# Altium schematic sheet 十二进十二出.SchDoc: Dozen IO控制器
size A4; Revision: V1.5; SheetNumber: 0; SheetTotal: 0; DrawnBy: 小熊
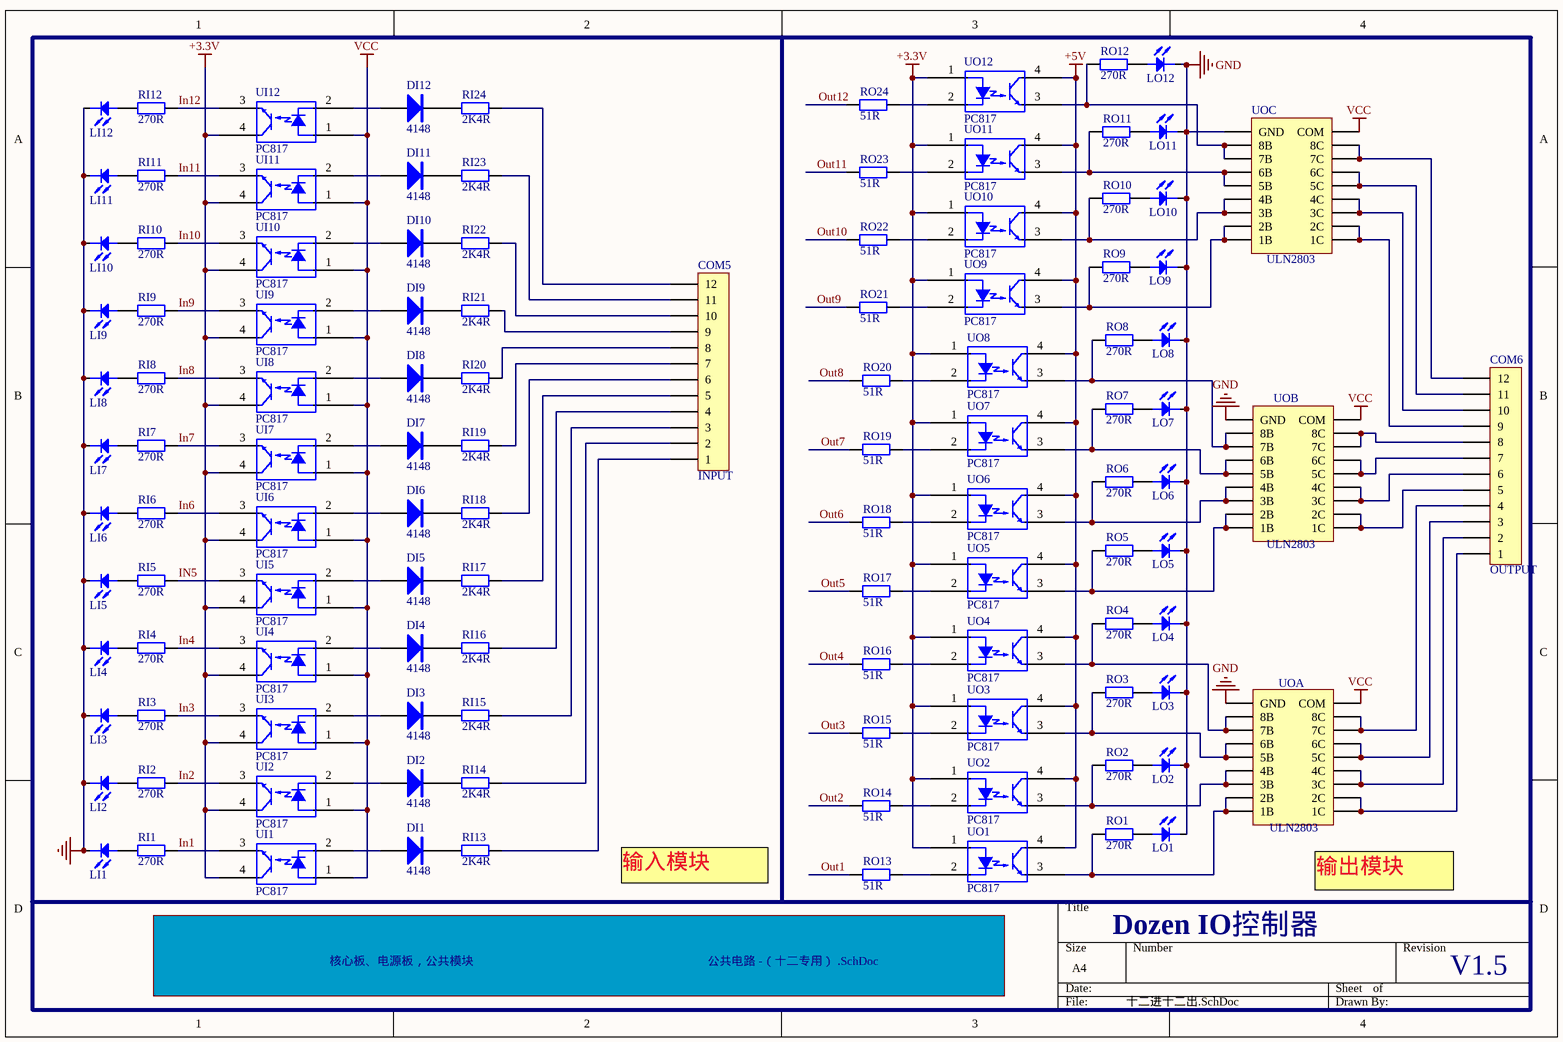
[diagram p0: 十二进十二出.SchDoc]

## Parts
COM5  INPUT  [CON12-5.1卧上]
COM6  OUTPUT  [CON12-5.1卧下]
DI1  4148  [1206C]
DI2  4148  [1206C]
DI3  4148  [1206C]
DI4  4148  [1206C]
DI5  4148  [1206C]
DI6  4148  [1206C]
DI7  4148  [1206C]
DI8  4148  [1206C]
DI9  4148  [1206C]
DI10  4148  [1206C]
DI11  4148  [1206C]
DI12  4148  [1206C]
LI1  LED  [SMDLED]  (value not drawn)
LI2  LED  [SMDLED]  (value not drawn)
LI3  LED  [SMDLED]  (value not drawn)
LI4  LED  [SMDLED]  (value not drawn)
LI5  LED  [SMDLED]  (value not drawn)
LI6  LED  [SMDLED]  (value not drawn)
LI7  LED  [SMDLED]  (value not drawn)
LI8  LED  [SMDLED]  (value not drawn)
LI9  LED  [SMDLED]  (value not drawn)
LI10  LED  [SMDLED]  (value not drawn)
LI11  LED  [SMDLED]  (value not drawn)
LI12  LED  [SMDLED]  (value not drawn)
LO1  LED  [SMDLED]  (value not drawn)
LO2  LED  [SMDLED]  (value not drawn)
LO3  LED  [SMDLED]  (value not drawn)
LO4  LED  [SMDLED]  (value not drawn)
LO5  LED  [SMDLED]  (value not drawn)
LO6  LED  [SMDLED]  (value not drawn)
LO7  LED  [SMDLED]  (value not drawn)
LO8  LED  [SMDLED]  (value not drawn)
LO9  LED  [SMDLED]  (value not drawn)
LO10  LED  [SMDLED]  (value not drawn)
LO11  LED  [SMDLED]  (value not drawn)
LO12  LED  [SMDLED]  (value not drawn)
RI1  270R  [0603A]
RI2  270R  [0603A]
RI3  270R  [0603A]
RI4  270R  [0603A]
RI5  270R  [0603A]
RI6  270R  [0603A]
RI7  270R  [0603A]
RI8  270R  [0603A]
RI9  270R  [0603A]
RI10  270R  [0603A]
RI11  270R  [0603A]
RI12  270R  [0603A]
RI13  2K4R  [0603A]
RI14  2K4R  [0603A]
RI15  2K4R  [0603A]
RI16  2K4R  [0603A]
RI17  2K4R  [0603A]
RI18  2K4R  [0603A]
RI19  2K4R  [0603A]
RI20  2K4R  [0603A]
RI21  2K4R  [0603A]
RI22  2K4R  [0603A]
RI23  2K4R  [0603A]
RI24  2K4R  [0603A]
RO1  270R  [0603A]
RO2  270R  [0603A]
RO3  270R  [0603A]
RO4  270R  [0603A]
RO5  270R  [0603A]
RO6  270R  [0603A]
RO7  270R  [0603A]
RO8  270R  [0603A]
RO9  270R  [0603A]
RO10  270R  [0603A]
RO11  270R  [0603A]
RO12  270R  [0603A]
RO13  51R  [0603A]
RO14  51R  [0603A]
RO15  51R  [0603A]
RO16  51R  [0603A]
RO17  51R  [0603A]
RO18  51R  [0603A]
RO19  51R  [0603A]
RO20  51R  [0603A]
RO21  51R  [0603A]
RO22  51R  [0603A]
RO23  51R  [0603A]
RO24  51R  [0603A]
UI1  PC817  [PC817]
UI2  PC817  [PC817]
UI3  PC817  [PC817]
UI4  PC817  [PC817]
UI5  PC817  [PC817]
UI6  PC817  [PC817]
UI7  PC817  [PC817]
UI8  PC817  [PC817]
UI9  PC817  [PC817]
UI10  PC817  [PC817]
UI11  PC817  [PC817]
UI12  PC817  [PC817]
UO1  PC817  [PC817]
UO2  PC817  [PC817]
UO3  PC817  [PC817]
UO4  PC817  [PC817]
UO5  PC817  [PC817]
UO6  PC817  [PC817]
UO7  PC817  [PC817]
UO8  PC817  [PC817]
UO9  PC817  [PC817]
UO10  PC817  [PC817]
UO11  PC817  [PC817]
UO12  PC817  [PC817]
UOA  ULN2803  [sol18]
UOB  ULN2803  [sol18]
UOC  ULN2803  [sol18]

## Sub-sheets
核心板、电源板，公共模块 = 公共电路 -（十二专用） .SchDoc: no entries

## Nets
+3.3V: UI1.4(COL) UI2.4(COL) UI3.4(COL) UI4.4(COL) UI5.4(COL) UI6.4(COL) UI7.4(COL) UI8.4(COL) UI9.4(COL) UI10.4(COL) UI11.4(COL) UI12.4(COL) UO1.1(ANODE) UO2.1(ANODE) UO3.1(ANODE) UO4.1(ANODE) UO5.1(ANODE) UO6.1(ANODE) UO7.1(ANODE) UO8.1(ANODE) UO9.1(ANODE) UO10.1(ANODE) UO11.1(ANODE) UO12.1(ANODE)
+5V: UO1.4(COL) UO2.4(COL) UO3.4(COL) UO4.4(COL) UO5.4(COL) UO6.4(COL) UO7.4(COL) UO8.4(COL) UO9.4(COL) UO10.4(COL) UO11.4(COL) UO12.4(COL)
GND: LI1.K LI2.K LI3.K LI4.K LI5.K LI6.K LI7.K LI8.K LI9.K LI10.K LI11.K LI12.K LO1.K LO2.K LO3.K LO4.K LO5.K LO6.K LO7.K LO8.K LO9.K LO10.K LO11.K LO12.K UOA.9(GND) UOB.9(GND) UOC.9(GND)
VCC: UI1.1(ANODE) UI2.1(ANODE) UI3.1(ANODE) UI4.1(ANODE) UI5.1(ANODE) UI6.1(ANODE) UI7.1(ANODE) UI8.1(ANODE) UI9.1(ANODE) UI10.1(ANODE) UI11.1(ANODE) UI12.1(ANODE) UOA.10(COM) UOB.10(COM) UOC.10(COM)
In1: RI1.1 UI1.3(EMIT)
In2: RI2.1 UI2.3(EMIT)
In3: RI3.1 UI3.3(EMIT)
In4: RI4.1 UI4.3(EMIT)
IN5: RI5.1 UI5.3(EMIT)
In6: RI6.1 UI6.3(EMIT)
In7: RI7.1 UI7.3(EMIT)
In8: RI8.1 UI8.3(EMIT)
In9: RI9.1 UI9.3(EMIT)
In10: RI10.1 UI10.3(EMIT)
In11: RI11.1 UI11.3(EMIT)
In12: RI12.1 UI12.3(EMIT)
Out1: RO13.1
Out2: RO14.1
Out3: RO15.1
Out4: RO16.1
Out5: RO17.1
Out6: RO18.1
Out7: RO19.1
Out8: RO20.1
Out9: RO21.1
Out10: RO22.1
Out11: RO23.1
Out12: RO24.1
NetCOM5_1: COM5.1 RI13.2
NetCOM5_2: COM5.2 RI14.2
NetCOM5_3: COM5.3 RI15.2
NetCOM5_4: COM5.4 RI16.2
NetCOM5_5: COM5.5 RI17.2
NetCOM5_6: COM5.6 RI18.2
NetCOM5_7: COM5.7 RI19.2
NetCOM5_8: COM5.8 RI20.2
NetCOM5_9: COM5.9 RI21.2
NetCOM5_10: COM5.10 RI22.2
NetCOM5_11: COM5.11 RI23.2
NetCOM5_12: COM5.12 RI24.2
NetCOM6_1: COM6.1 UOA.17(2C) UOA.18(1C)
NetCOM6_2: COM6.2 UOA.15(4C) UOA.16(3C)
NetCOM6_3: COM6.3 UOA.13(6C) UOA.14(5C)
NetCOM6_4: COM6.4 UOA.11(8C) UOA.12(7C)
NetCOM6_5: COM6.5 UOB.17(2C) UOB.18(1C)
NetCOM6_6: COM6.6 UOB.15(4C) UOB.16(3C)
NetCOM6_7: COM6.7 UOB.13(6C) UOB.14(5C)
NetCOM6_8: COM6.8 UOB.11(8C) UOB.12(7C)
NetCOM6_9: COM6.9 UOC.17(2C) UOC.18(1C)
NetCOM6_10: COM6.10 UOC.15(4C) UOC.16(3C)
NetCOM6_11: COM6.11 UOC.13(6C) UOC.14(5C)
NetCOM6_12: COM6.12 UOC.11(8C) UOC.12(7C)
NetDI1_A: DI1.A UI1.2(CATH)
NetDI1_K: DI1.K RI13.1
NetDI2_A: DI2.A UI2.2(CATH)
NetDI2_K: DI2.K RI14.1
NetDI3_A: DI3.A UI3.2(CATH)
NetDI3_K: DI3.K RI15.1
NetDI4_A: DI4.A UI4.2(CATH)
NetDI4_K: DI4.K RI16.1
NetDI5_A: DI5.A UI5.2(CATH)
NetDI5_K: DI5.K RI17.1
NetDI6_A: DI6.A UI6.2(CATH)
NetDI6_K: DI6.K RI18.1
NetDI7_A: DI7.A UI7.2(CATH)
NetDI7_K: DI7.K RI19.1
NetDI8_A: DI8.A UI8.2(CATH)
NetDI8_K: DI8.K RI20.1
NetDI9_A: DI9.A UI9.2(CATH)
NetDI9_K: DI9.K RI21.1
NetDI10_A: DI10.A UI10.2(CATH)
NetDI10_K: DI10.K RI22.1
NetDI11_A: DI11.A UI11.2(CATH)
NetDI11_K: DI11.K RI23.1
NetDI12_A: DI12.A UI12.2(CATH)
NetDI12_K: DI12.K RI24.1
NetLI1_A: LI1.A RI1.2
NetLI2_A: LI2.A RI2.2
NetLI3_A: LI3.A RI3.2
NetLI4_A: LI4.A RI4.2
NetLI5_A: LI5.A RI5.2
NetLI6_A: LI6.A RI6.2
NetLI7_A: LI7.A RI7.2
NetLI8_A: LI8.A RI8.2
NetLI9_A: LI9.A RI9.2
NetLI10_A: LI10.A RI10.2
NetLI11_A: LI11.A RI11.2
NetLI12_A: LI12.A RI12.2
NetLO1_A: LO1.A RO1.2
NetLO2_A: LO2.A RO2.2
NetLO3_A: LO3.A RO3.2
NetLO4_A: LO4.A RO4.2
NetLO5_A: LO5.A RO5.2
NetLO6_A: LO6.A RO6.2
NetLO7_A: LO7.A RO7.2
NetLO8_A: LO8.A RO8.2
NetLO9_A: LO9.A RO9.2
NetLO10_A: LO10.A RO10.2
NetLO11_A: LO11.A RO11.2
NetLO12_A: LO12.A RO12.2
NetRO1_1: RO1.1 UO1.3(EMIT) UOA.1(1B) UOA.2(2B)
NetRO2_1: RO2.1 UO2.3(EMIT) UOA.3(3B) UOA.4(4B)
NetRO3_1: RO3.1 UO3.3(EMIT) UOA.5(5B) UOA.6(6B)
NetRO4_1: RO4.1 UO4.3(EMIT) UOA.7(7B) UOA.8(8B)
NetRO5_1: RO5.1 UO5.3(EMIT) UOB.1(1B) UOB.2(2B)
NetRO6_1: RO6.1 UO6.3(EMIT) UOB.3(3B) UOB.4(4B)
NetRO7_1: RO7.1 UO7.3(EMIT) UOB.5(5B) UOB.6(6B)
NetRO8_1: RO8.1 UO8.3(EMIT) UOB.7(7B) UOB.8(8B)
NetRO9_1: RO9.1 UO9.3(EMIT) UOC.1(1B) UOC.2(2B)
NetRO10_1: RO10.1 UO10.3(EMIT) UOC.3(3B) UOC.4(4B)
NetRO11_1: RO11.1 UO11.3(EMIT) UOC.5(5B) UOC.6(6B)
NetRO12_1: RO12.1 UO12.3(EMIT) UOC.7(7B) UOC.8(8B)
NetRO13_2: RO13.2 UO1.2(CATH)
NetRO14_2: RO14.2 UO2.2(CATH)
NetRO15_2: RO15.2 UO3.2(CATH)
NetRO16_2: RO16.2 UO4.2(CATH)
NetRO17_2: RO17.2 UO5.2(CATH)
NetRO18_2: RO18.2 UO6.2(CATH)
NetRO19_2: RO19.2 UO7.2(CATH)
NetRO20_2: RO20.2 UO8.2(CATH)
NetRO21_2: RO21.2 UO9.2(CATH)
NetRO22_2: RO22.2 UO10.2(CATH)
NetRO23_2: RO23.2 UO11.2(CATH)
NetRO24_2: RO24.2 UO12.2(CATH)

## Notes on the sheet
- 输入模块
- (near UOA) 输出模块

## Library data of the parts
COM5 COM6 = CON12
RI1-RI24 RO1-RO24 = Res2: Resistor; Value: 1K; Published: 8-Jun-2000; LatestRevisionDate: 17-Jul-2002; LatestRevisionNote: Re-released for DXP Platform.; PackageReference: AXIAL-0.4; Publisher: Altium Limited
UI1-UI12 UO1-UO12 = TLP521-1: Single NPN PhotoTransistor OptoCoupler.